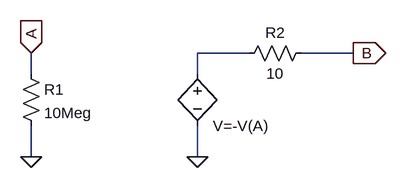
[diagram p0: schematic Inverter5.asc]
Inverter5.asc, the LTspice schematic file:
Version 4
SHEET 1 880 680
WIRE 272 80 192 80
WIRE 432 80 352 80
WIRE -64 112 -64 80
WIRE 192 112 192 80
WIRE -64 240 -64 192
WIRE 192 240 192 192
FLAG 432 80 B
IOPIN 432 80 Out
FLAG 192 240 0
FLAG -64 80 A
IOPIN -64 80 In
FLAG -64 240 0
SYMBOL bv 192 96 R0
WINDOW 0 24 16 Invisible 2
SYMATTR InstName B1
SYMATTR Value V=-V(A)
SYMBOL res -80 96 R0
SYMATTR InstName R1
SYMATTR Value 10Meg
SYMBOL res 368 64 R90
WINDOW 0 0 56 VBottom 2
WINDOW 3 32 56 VTop 2
SYMATTR InstName R2
SYMATTR Value 10

The netlist it stands for:
* Inverter5.asc
B1 N001 0 V=-V(A)
R1 A 0 10Meg
R2 B N001 10
.backanno
.end